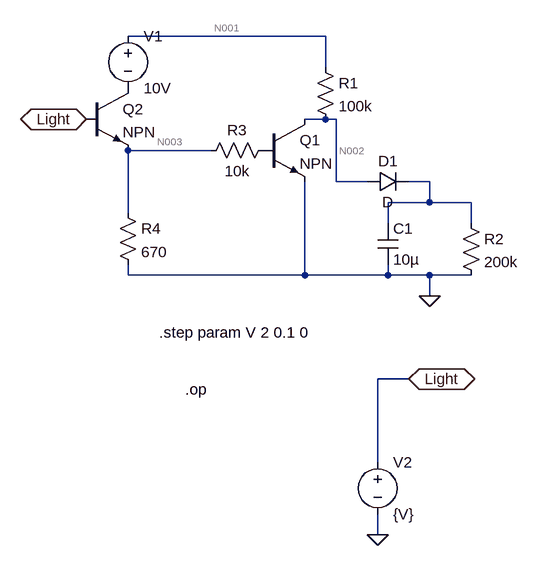
[diagram p0: schematic Lichtschranke0v.asc]
Lichtschranke0v.asc, the LTspice schematic file:
Version 4
SHEET 1 880 772
WIRE 320 -16 16 -16
WIRE 320 32 320 -16
WIRE 320 112 288 112
WIRE 336 112 320 112
WIRE 144 160 16 160
WIRE 336 208 336 112
WIRE 384 208 336 208
WIRE 480 208 448 208
WIRE 480 240 480 208
WIRE 480 240 416 240
WIRE 544 240 480 240
WIRE 16 256 16 160
WIRE 416 272 416 240
WIRE 544 272 544 240
WIRE 16 352 16 336
WIRE 288 352 288 208
WIRE 288 352 16 352
WIRE 416 352 416 336
WIRE 416 352 288 352
WIRE 480 352 416 352
WIRE 544 352 480 352
WIRE 480 384 480 352
WIRE 448 512 400 512
WIRE 400 640 400 512
WIRE 400 752 400 720
FLAG 480 384 0
FLAG 400 752 0
FLAG 448 512 Light
IOPIN 448 512 BiDir
FLAG -48 112 Light
IOPIN -48 112 BiDir
SYMBOL res 304 16 R0
SYMATTR InstName R1
SYMATTR Value 100k
SYMBOL voltage 16 -32 R0
WINDOW 123 0 0 Left 2
WINDOW 39 0 0 Left 2
SYMATTR InstName V1
SYMATTR Value 10V
SYMBOL diode 384 224 R270
WINDOW 0 32 32 VTop 2
WINDOW 3 0 32 VBottom 2
SYMATTR InstName D1
SYMBOL cap 400 272 R0
SYMATTR InstName C1
SYMATTR Value 10µ
SYMBOL res 528 256 R0
SYMATTR InstName R2
SYMATTR Value 200k
SYMBOL npn 224 112 R0
SYMATTR InstName Q1
SYMBOL res 240 144 R90
WINDOW 0 0 56 VBottom 2
WINDOW 3 32 56 VTop 2
SYMATTR InstName R3
SYMATTR Value 10k
SYMBOL npn -48 64 R0
SYMATTR InstName Q2
SYMBOL res 0 240 R0
SYMATTR InstName R4
SYMATTR Value 670
SYMBOL voltage 400 624 R0
WINDOW 123 0 0 Left 2
WINDOW 39 0 0 Left 2
SYMATTR InstName V2
SYMATTR Value {V}
TEXT 104 528 Left 2 !.op
TEXT 64 440 Left 2 !.step param V 2 0.1 0

The netlist it stands for:
* Lichtschranke0v.asc
R1 N001 N002 100k
V1 N001 P001 10V
D1 N002 N004 D
C1 N004 0 10µ
R2 N004 0 200k
Q1 N002 P002 0 0 NPN
R3 P002 N003 10k
Q2 P001 Light N003 0 NPN
R4 N003 0 670
V2 Light 0 {V}
.model D D
.lib standard.dio
.model NPN NPN
.model PNP PNP
.lib standard.bjt
.op
.step param V 2 0.1 0
.backanno
.end

* Results of the author's LTspice run, read from the files saved beside the schematic
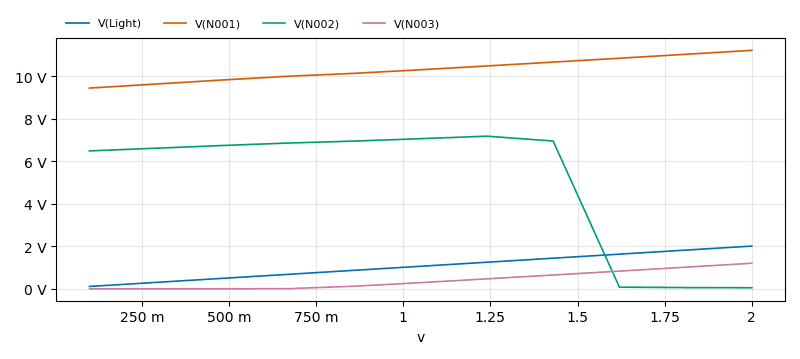
[diagram p1: Operating Point of Lichtschranke0v.asc, plotted from the saved traces]
* Operating Point, 1 run:
*   V(Light): 2 V at v=2 , 100 mV at v=100 m, min 100 mV, max 2 V
*   V(N001): 11.21 V at v=2 , 9.435 V at v=100 m, min 9.435 V, max 11.21 V
*   V(N002): 39.14 mV at v=2 , 6.478 V at v=100 m, min 39.14 mV, max 7.172 V
*   V(N003): 1.192 V at v=2 , -9.906 mV at v=100 m, min -10.32 mV, max 1.192 V
* From the log:
*   Semiconductor Device Operating Points:
*                           --- Diodes ---
*   Name:      d1
*   Model:      d
*   Id:      7.46e-14
*   Vd:      3.91e-02
*   Req:     3.63e+11
*   CAP:     0.00e+00
*                           --- Bipolar Transistors ---
*   Name:       q2          q1
*   Model:      npn         npn
*   Ib:       1.94e-03    4.59e-05
*   Ic:      -1.12e-04    1.12e-04
*   Vbe:      8.08e-01    7.33e-01
*   Vbc:      7.91e-01    6.93e-01
*   Vce:      1.72e-02    3.91e-02
*   BetaDC:  -5.77e-02    2.43e+00
*   Gm:       6.91e-02    6.02e-03
*   Rpi:      7.01e+02    1.30e+04
*   Rx:       0.00e+00    0.00e+00
*   Ro:       1.36e+01    5.89e+02
*   Cbe:      0.00e+00    0.00e+00
*   Cbc:      0.00e+00    0.00e+00
*   Cjs:      0.00e+00    0.00e+00
*   BetaAC:   4.85e+01    7.80e+01
*   Cbx:      0.00e+00    0.00e+00
*   Ft:       0.00e+00    0.00e+00